# Altium schematic sheet Page-4.schdoc: ETHERNET PHY 10/100/1000
size 311 x 208 mm; CompanyName: InSYS; DrawnBy: NaveenKumar; Revision: 2.0; SheetNumber: 4; SheetTotal: 10; Title2: Gateway
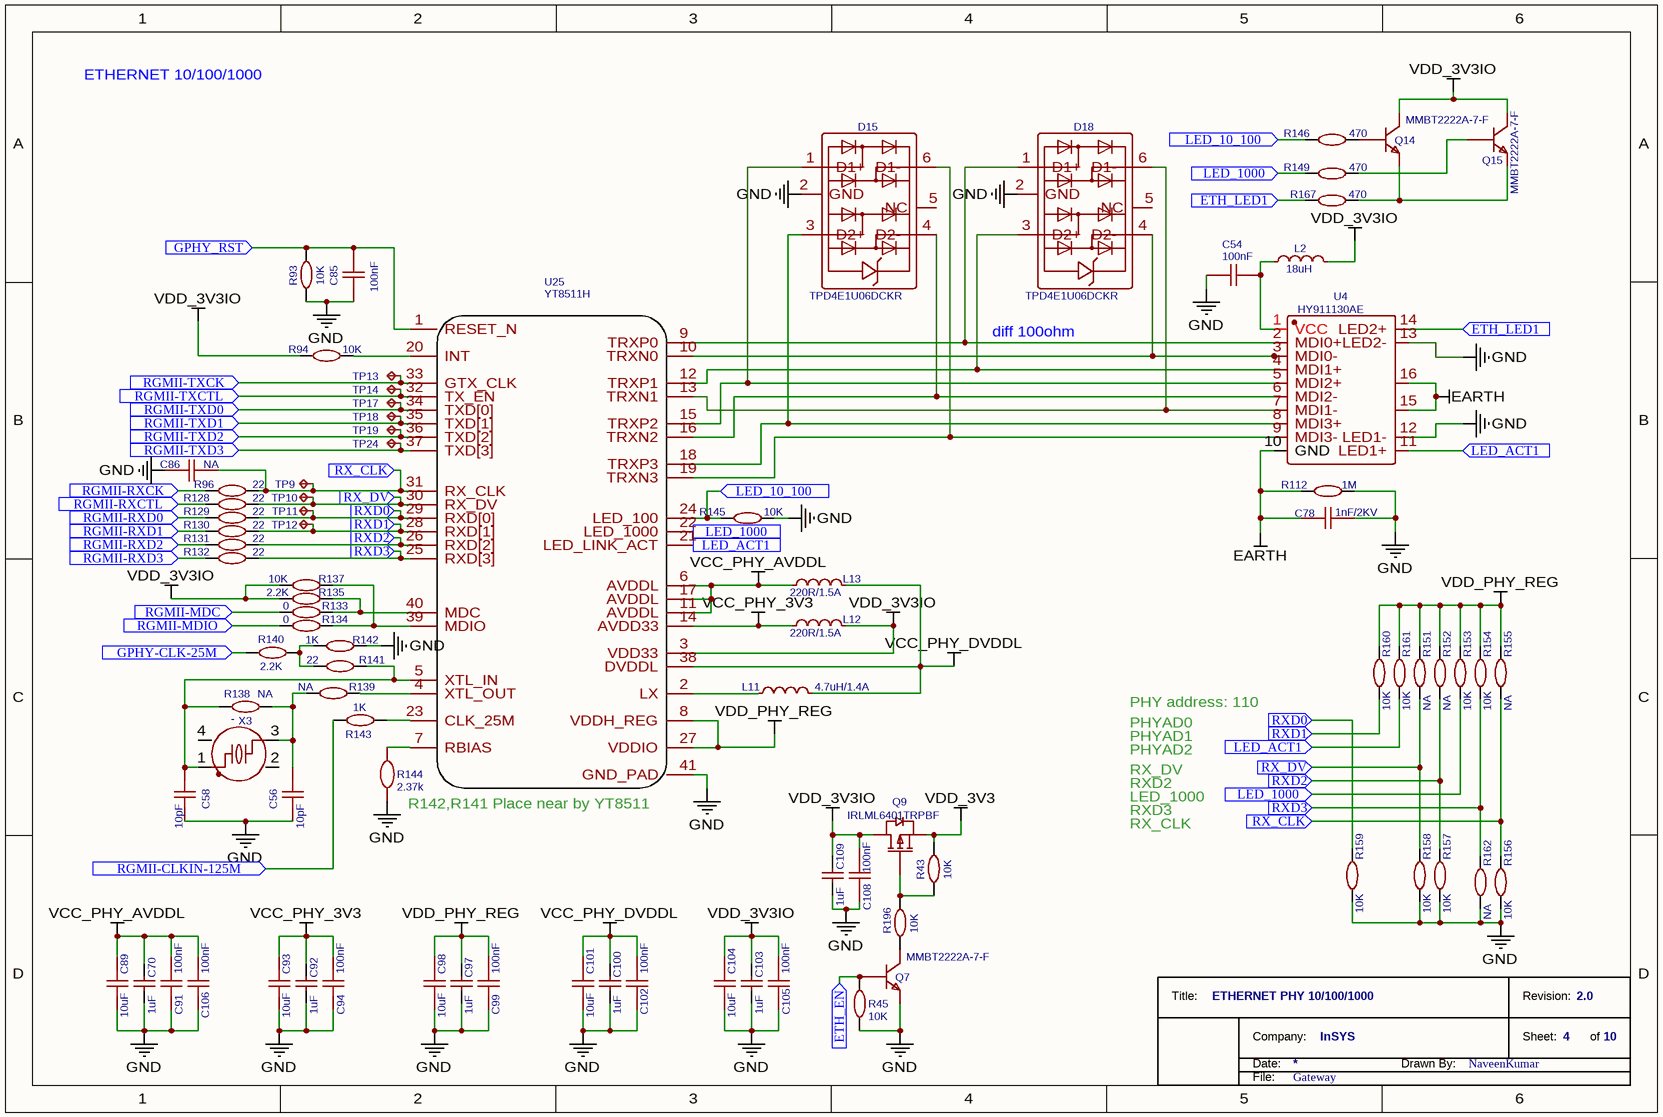
[diagram p0: Page-4.schdoc]

## Parts
*  TitleBlock_1  (value not drawn)  (graphical)
C54  100nF  [GWAY_Capacitor_0603]
C56  10pF  [GWAY_Capacitor_0603]
C58  10pF  [GWAY_Capacitor_0603]
C70  1uF  [GWAY_Capacitor_0603]
C78  1nF/2KV  [GWAY_Capacitor_1206]
C85  100nF  [GWAY_Capacitor_0603]
C86  NA  [GWAY_Capacitor_0603]
C89  10uF  [GWAY_Capacitor_0805]
C91  100nF  [GWAY_Capacitor_0603]
C92  1uF  [GWAY_Capacitor_0603]
C93  10uF  [GWAY_Capacitor_0805]
C94  100nF  [GWAY_Capacitor_0603]
C97  1uF  [GWAY_Capacitor_0603]
C98  10uF  [GWAY_Capacitor_0805]
C99  100nF  [GWAY_Capacitor_0603]
C100  1uF  [GWAY_Capacitor_0603]
C101  10uF  [GWAY_Capacitor_0805]
C102  100nF  [GWAY_Capacitor_0603]
C103  1uF  [GWAY_Capacitor_0603]
C104  10uF  [GWAY_Capacitor_0805]
C105  100nF  [GWAY_Capacitor_0603]
C106  100nF  [GWAY_Capacitor_0603]
C108  100nF  [GWAY_Capacitor_0603]
C109  1uF  [GWAY_Capacitor_0603]
D15  TPD4E1U06DCKR  [GWAY_SC70-6PIN]
D18  TPD4E1U06DCKR  [GWAY_SC70-6PIN]
L2  18uH  [GWAY_FerriteeBEAD_0805_C2012X105N]
L11  4.7uH/1.4A  [GWAY_IND1210]
L12  220R/1.5A  [GWAY_Inductor_0603]
L13  220R/1.5A  [GWAY_Inductor_0603]
Q7  MMBT2222A-7-F  [GWAY_SOT23-3PIN]
Q9  IRLML6401TRPBF  [GWAY_SOT23-3PIN]
Q14  MMBT2222A-7-F  [GWAY_SOT23-3PIN]
Q15  MMBT2222A-7-F  [GWAY_SOT23-3PIN]
R43  10K  [GWAY_Resistor_0603]
R45  10K  [GWAY_Resistor_0603]
R93  10K  [GWAY_Resistor_0603]
R94  10K  [GWAY_Resistor_0603]
R96  22  [GWAY_Resistor_0603]
R112  1M  [GWAY_Resistor_0603]
R128  22  [GWAY_Resistor_0603]
R129  22  [GWAY_Resistor_0603]
R130  22  [GWAY_Resistor_0603]
R131  22  [GWAY_Resistor_0603]
R132  22  [GWAY_Resistor_0603]
R133  0  [GWAY_Resistor_0603]
R134  0  [GWAY_Resistor_0603]
R135  2.2K  [GWAY_Resistor_0603]
R137  10K  [GWAY_Resistor_0603]
R138  NA  [GWAY_Resistor_0603]
R139  NA  [GWAY_Resistor_0603]
R140  2.2K  [GWAY_Resistor_0603]
R141  22  [GWAY_Resistor_0603]
R142  1K  [GWAY_Resistor_0603]
R143  1K  [GWAY_Resistor_0603]
R144  2.37k  [GWAY_Resistor_0603]
R145  10K  [GWAY_Resistor_0603]
R146  470  [GWAY_Resistor_0603]
R149  470  [GWAY_Resistor_0603]
R151  NA  [GWAY_Resistor_0603]
R152  NA  [GWAY_Resistor_0603]
R153  10K  [GWAY_Resistor_0603]
R154  10K  [GWAY_Resistor_0603]
R155  NA  [GWAY_Resistor_0603]
R156  10K  [GWAY_Resistor_0603]
R157  10K  [GWAY_Resistor_0603]
R158  10K  [GWAY_Resistor_0603]
R159  10K  [GWAY_Resistor_0603]
R160  10K  [GWAY_Resistor_0603]
R161  10K  [GWAY_Resistor_0603]
R162  NA  [GWAY_Resistor_0603]
R167  470  [GWAY_Resistor_0603]
R196  10K  [GWAY_Resistor_0603]
TP9  TP-052-TJ  [GWAY_TESTPOINT1]  (value not drawn)
TP10  TP-052-TJ  [GWAY_TESTPOINT1]  (value not drawn)
TP11  TP-052-TJ  [GWAY_TESTPOINT1]  (value not drawn)
TP12  TP-052-TJ  [GWAY_TESTPOINT1]  (value not drawn)
TP13  TP-052-TJ  [GWAY_TESTPOINT1]  (value not drawn)
TP14  TP-052-TJ  [GWAY_TESTPOINT1]  (value not drawn)
TP17  TP-052-TJ  [GWAY_TESTPOINT1]  (value not drawn)
TP18  TP-052-TJ  [GWAY_TESTPOINT1]  (value not drawn)
TP19  TP-052-TJ  [GWAY_TESTPOINT1]  (value not drawn)
TP24  TP-052-TJ  [GWAY_TESTPOINT1]  (value not drawn)
U4  HY911130AE  [GWay_HY911130AE]
U25  YT8511H  [GWAY_QFN_40Pin_5X5X1mm]
X3  -  [GWAY_CRYSTAL 25MHZ 8PF SMD]

## Ports
ETH_EN (in), ETH_LED1 (in), GPHY-CLK-25M (in), GPHY_RST (in), LED_10_100 (in), LED_1000 (in), LED_ACT1 (in), RGMII-CLKIN-125M (in), RGMII-MDC (in), RGMII-MDIO (in), RGMII-RXCK (in), RGMII-RXCTL (in), RGMII-RXD0 (in), RGMII-RXD1 (in), RGMII-RXD2 (in), RGMII-RXD3 (in), RGMII-TXCK (in), RGMII-TXCTL (in), RGMII-TXD0 (in), RGMII-TXD1 (in), RGMII-TXD2 (in), RGMII-TXD3 (in), RX_CLK (in), RX_DV (in), RXD0 (in), RXD1 (in), RXD2 (in), RXD3 (in)

## Nets
EARTH: C78.2 R112.1 U4.10(GND) U4.15(EH) U4.16(EH)
GND: C54.1 C56.2 C58.2 C70.2 C78.1 C85.2 C86.1 C89.1 C91.2 C92.2 C93.1 C94.2 C97.2 C98.1 C99.2 C100.2 C101.1 C102.2 C103.2 C104.1 C105.2 C106.2 C108.2 C109.2 D15.2(GND) D18.2(GND) Q7.2(E) R45.1 R93.2 R112.2 R142.2 R144.1 R145.2 R156.2 R157.2 R158.2 R159.2 R162.2 U4.12(LED1-) U4.13(LED2-) U25.41(GND_PAD)
VCC_PHY_3V3: C92.1 C93.2 C94.1 L12.1 U25.14(AVDD33)
VCC_PHY_AVDDL: C70.1 C89.2 C91.1 C106.1 L13.1 U25.6(AVDDL) U25.11(AVDDL) U25.17(AVDDL)
VCC_PHY_DVDDL: C100.1 C101.2 C102.1 L11.2 L13.2 U25.38(DVDDL)
VDD_3V3: Q9.2(S) R43.1
VDD_3V3IO: C103.1 C104.2 C105.1 C108.1 C109.1 L2.2 L12.2 Q9.3(D) Q14.3(C) Q15.3(C) R94.1 R135.1 R137.1 U25.3(VDD33)
VDD_PHY_REG: C97.1 C98.2 C99.1 R151.1 R152.1 R153.1 R154.1 R155.1 R160.1 R161.1 U25.8(VDDH_REG) U25.27(VDDIO)
ETH_EN: Q7.1(B) R45.2 ; port ETH_EN
ETH_LED1: R167.1 U4.14(LED2+) ; port ETH_LED1
GPHY-CLK-25M: R140.1 ; port GPHY-CLK-25M
GPHY_RST: C85.1 R93.1 U25.1(RESET_N) ; port GPHY_RST
LED_10_100: R145.1 R146.2 U25.24(LED_100) ; port LED_10_100
LED_1000: R149.2 R153.2 U25.22(LED_1000) ; port LED_1000
LED_ACT1: R161.2 U4.11(LED1+) U25.21(LED_LINK_ACT) ; port LED_ACT1
RGMII-CLKIN-125M: R143.1 ; port RGMII-CLKIN-125M
RGMII-MDC: R133.2 ; port RGMII-MDC
RGMII-MDIO: R134.2 ; port RGMII-MDIO
RGMII-RXCK: R96.1 ; port RGMII-RXCK
RGMII-RXCTL: R128.1 ; port RGMII-RXCTL
RGMII-RXD0: R129.1 ; port RGMII-RXD0
RGMII-RXD1: R130.1 ; port RGMII-RXD1
RGMII-RXD2: R131.1 ; port RGMII-RXD2
RGMII-RXD3: R132.1 ; port RGMII-RXD3
RGMII-TXCK: TP13.1 U25.33(GTX_CLK) ; port RGMII-TXCK
RGMII-TXCTL: TP14.1 U25.32(TX_EN) ; port RGMII-TXCTL
RGMII-TXD0: TP17.1 U25.34(TXD[0]) ; port RGMII-TXD0
RGMII-TXD1: TP18.1 U25.35(TXD[1]) ; port RGMII-TXD1
RGMII-TXD2: TP19.1 U25.36(TXD[2]) ; port RGMII-TXD2
RGMII-TXD3: TP24.1 U25.37(TXD[3]) ; port RGMII-TXD3
RX_CLK: C86.2 R96.2 R155.2 R156.1 TP9.1 U25.31(RX_CLK) ; port RX_CLK
RX_DV: R128.2 R151.2 R158.1 TP10.1 U25.30(RX_DV) ; port RX_DV
RXD0: R129.2 R159.1 TP11.1 U25.29(RXD[0]) ; port RXD0
RXD1: R130.2 R160.2 TP12.1 U25.28(RXD[1]) ; port RXD1
RXD2: R131.2 R152.2 R157.1 U25.26(RXD[2]) ; port RXD2
RXD3: R132.2 R154.2 R162.1 U25.25(RXD[3]) ; port RXD3
NetC54_2: C54.2 L2.1 U4.1(VCC)
NetC56_1: C56.1 R138.2 R139.2 X3.3
NetC58_1: C58.1 R138.1 R141.2 U25.5(XTL_IN) X3.1
NetD15_1: D15.1(D1+) U4.5(MDI2+) U25.15(TRXP2)
NetD15_3: D15.3(D2+) U4.8(MDI3+) U25.18(TRXP3)
NetD15_4: D15.4(D2-) U4.6(MDI2-) U25.16(TRXN2)
NetD15_6: D15.6(D1-) U4.9(MDI3-) U25.19(TRXN3)
NetD18_1: D18.1(D1+) U4.2(MDI0+) U25.9(TRXP0)
NetD18_3: D18.3(D2+) U4.4(MDI1+) U25.12(TRXP1)
NetD18_4: D18.4(D2-) U4.3(MDI0-) U25.10(TRXN0)
NetD18_6: D18.6(D1-) U4.7(MDI1-) U25.13(TRXN1)
NetL11_1: L11.1 U25.2(LX)
NetQ7_3: Q7.3(C) R196.2
NetQ9_1: Q9.1(G) R43.2 R196.1
NetQ14_1: Q14.1(B) R146.1
NetQ14_2: Q14.2(E) Q15.2(E) R167.2
NetQ15_1: Q15.1(B) R149.1
NetR94_2: R94.2 U25.20(INT)
NetR133_1: R133.1 R135.2 U25.40(MDC)
NetR134_1: R134.1 R137.2 U25.39(MDIO)
NetR139_1: R139.1 U25.4(XTL_OUT)
NetR140_2: R140.2 R141.1 R142.1
NetR143_2: R143.2 U25.23(CLK_25M)
NetR144_2: R144.2 U25.7(RBIAS)

Not connected (* = marked no-connect by the designer): D15 5(NC); D18 5(NC); X3 2(GND) 4(GND)

## Notes on the sheet
- ETHERNET 10/100/1000
- diff 100ohm
- PHY address: 110
- PHYAD0
- PHYAD1
- PHYAD2
- RX_DV
- RXD2
- LED_1000
- R142,R141 Place near by YT8511
- RXD3
- RX_CLK
- (in symbol TitleBlock_1) Title:; Revision:; Company:; Sheet:; of; Date:; Drawn By:; File:

## Library data of the parts
* = TitleBlock_1: TitleBlock  No-2; TitleName: *; Company: *; Drawn By: *; File: *
C54 C85 C91 C94 C99 C102 C105 C106 C108 = 100nF: Manufacturer: SAMSUNG; Manufacturer Part: CL10B104KB8NNNC; nameAlias: Capacitance; Supplier: LCSC; Supplier Part: C1591; spicePre: C; spiceSymbolName: CL10B104KB8NNNC
C56 C58 = 10pF: Manufacturer: YAGEO(国巨); Manufacturer Part: CC0603FRNPO9BN100; nameAlias: Value; Contributor: LCSC; Supplier: LCSC; Supplier Part: C309467; JLCPCB Part Class: Extended Part; link: https://lcsc.com/eda_search?q=C309467&%26type=1&ref=editor; spicePre: C; spiceSymbolName: CC0603FRNPO9BN100
C70 C92 C97 C100 C103 C109 = 1uF: Manufacturer Part: CL10B105KA8NNNC; Manufacturer: SAMSUNG(三星); nameAlias: Capacitance; Supplier: LCSC; Supplier Part: C29936; JLCPCB Part Class: Extended Part; spicePre: C; spiceSymbolName: CL10B105KA8NNNC
C78 = 1nF/2KV: Manufacturer: Walsin Tech Corp; Manufacturer Part: 1206B102K202CT; nameAlias: Capacitance; Contributor: LCSC; Supplier: LCSC; Supplier Part: C303946; spicePre: C; spiceSymbolName: 1206B102K202CT
C86 = NA: Manufacturer: SAMSUNG; Manufacturer Part: CL10B104KB8NNNC; nameAlias: Capacitance; Supplier: LCSC; Supplier Part: C1591; spicePre: C; spiceSymbolName: CL10B104KB8NNNC
C89 C93 C98 C101 C104 = 10uF: Manufacturer: SAMSUNG(三星); Manufacturer Part: CL21B106KOQNNNE; nameAlias: Capacitance; Supplier: LCSC; Supplier Part: C95841; JLCPCB Part Class: Extended Part; spicePre: C; spiceSymbolName: CL21B106KOQNNNE
D15 D18 = TPD4E1U06DCKR: Manufacturer: Texas Instruments; Contributor: LCSC; Supplier: LCSC; Supplier Part: C194628; Manufacturer Part: TPD4E1U06DCKR; JLCPCB Part Class: Extended Part; spicePre: D; spiceSymbolName: TPD4E1U06DCKR
L2 = 18uH: Manufacturer Part: MLI2012-180; Manufacturer: ReliaPro; nameAlias: Inductance; Supplier: LCSC; Supplier Part: C42027; JLCPCB Part Class: Extended Part; spicePre: L; spiceSymbolName: MLI2012-180
L11 = 4.7uH/1.4A: Manufacturer: muRata(村田); Manufacturer Part: 1277AS-H-4R7M=P2; nameAlias: Inductance; Contributor: LCSC; Supplier: LCSC; Supplier Part: C237389; JLCPCB Part Class: Extended Part; spicePre: L; spiceSymbolName: 1277AS-H-4R7M=P2
L12 L13 = 220R/1.5A: Manufacturer: TDK; Manufacturer Part: MPZ1608Y221BTA00; Contributor: LCSC; Supplier: LCSC; Supplier Part: C275489; JLCPCB Part Class: Extended Part; spicePre: L; spiceSymbolName: MPZ1608Y221BTA00
Q7 Q14 Q15 = MMBT2222A-7-F: Manufacturer: DIODES(美台); Contributor: LCSC; Supplier: LCSC; Supplier Part: C94515; Manufacturer Part: MMBT2222A-7-F; JLCPCB Part Class: Extended Part; spicePre: Q; spiceSymbolName: MMBT2222A-7-F
Q9 = IRLML6401TRPBF: Manufacturer: Infineon(英飞凌); Supplier: LCSC; Manufacturer Part: IRLML6401TRPBF; Supplier Part: C3034; JLCPCB Part Class: Extended Part; spicePre: Q; spiceSymbolName: IRLML6401TRPBF
R43 R45 R93 R94 R137 R145 R153 R154 R156-R161 R196 = 10K: Manufacturer: YAGEO; Manufacturer Part: RC0603JR-0710KL; nameAlias: Resistance (Ohms); Supplier: LCSC; Supplier Part: C99198; spicePre: R; spiceSymbolName: RC0603JR-0710KL
R96 R128-R132 R141 = 22: Manufacturer: YAGEO; Manufacturer Part: RC0603FR-0722RL; nameAlias: Resistance (Ohms); Supplier: LCSC; Supplier Part: C107701; spicePre: R; spiceSymbolName: RC0603FR-0722RL
R112 = 1M: Manufacturer: YAGEO; Manufacturer Part: RC0603FR-071ML; nameAlias: Resistance (Ohms); Supplier: LCSC; Supplier Part: C105578; spicePre: R; spiceSymbolName: RC0603FR-071ML
R133 R134 = 0: Manufacturer: YAGEO; Manufacturer Part: RC0603FR-070RL; nameAlias: Resistance (Ohms); Supplier: LCSC; Supplier Part: C100044; spicePre: R; spiceSymbolName: RC0603FR-070RL
R135 R140 = 2.2K: Manufacturer: YAGEO(国巨); Manufacturer Part: RC0603FR-072K2L; nameAlias: Resistance (Ohms); Resistance: 2.2kΩ; Supplier: LCSC; Supplier Part: C114662; JLCPCB Part Class: Extended Part; spicePre: R; spiceSymbolName: RC0603FR-072K2L
R138 = NA: Manufacturer: YAGEO(国巨); Manufacturer Part: AC0603FR-071ML; nameAlias: Resistance (Ohms); Resistance: 1MΩ; Supplier: LCSC; Supplier Part: C116678; JLCPCB Part Class: Extended Part; spicePre: R; spiceSymbolName: AC0603FR-071ML
R139 = NA: Manufacturer: YAGEO; Manufacturer Part: RC0603FR-070RL; nameAlias: Resistance (Ohms); Supplier: LCSC; Supplier Part: C100044; spicePre: R; spiceSymbolName: RC0603FR-070RL
R142 R143 = 1K: Manufacturer Part: RC0603FR-071KL; Manufacturer: YAGEO; nameAlias: Resistance (Ohms); Supplier: LCSC; Supplier Part: C22548; spicePre: R; spiceSymbolName: RC0603FR-071KL
R144 = 2.37k: Manufacturer: YAGEO(国巨); Manufacturer Part: RC0603FR-072K37L; Contributor: LCSC; Resistance: 2.37kΩ; Supplier: LCSC; Supplier Part: C482793; JLCPCB Part Class: Extended Part; spicePre: R; spiceSymbolName: RC0603FR-072K37L
R146 R149 R167 = 470: Manufacturer: YAGEO; Manufacturer Part: RC0603FR-07470RL; nameAlias: Resistance (Ohms); Resistance: 470Ω; Supplier: LCSC; Supplier Part: C114669; JLCPCB Part Class: Extended Part; spicePre: R; spiceSymbolName: RC0603FR-07470RL
R151 R152 R155 R162 = NA: Manufacturer: YAGEO; Manufacturer Part: RC0603JR-0710KL; nameAlias: Resistance (Ohms); Supplier: LCSC; Supplier Part: C99198; spicePre: R; spiceSymbolName: RC0603JR-0710KL
U4 = HY911130AE: Manufacturer: null; Contributor: LCSC; Supplier: LCSC; Supplier Part: C9900000469; Manufacturer Part: HY911130AE; spicePre: U; spiceSymbolName: HY911130AE
U25 = YT8511H: Contributor: Babu karivaratharaj; spicePre: U; spiceSymbolName: YT8511H
X3 = -: Manufacturer: NDK; Manufacturer Part: NX3225GA-25MHZ-STD-CRG-2; nameAlias: Value; Contributor: LCSC; Supplier: LCSC; Supplier Part: C438901; JLCPCB Part Class: Extended Part; link: https://lcsc.com/eda_search?q=C438901&%26type=1&ref=editor; spicePre: X; spiceSymbolName: NX3225GA-25MHZ-STD-CRG-2
TP9-TP14 TP17-TP19 TP24 = TP-052-TJ: Manufacturer Part: ?; spicePre: T